# EAGLE design markIII_adapter (EAGLE 7.6.0)
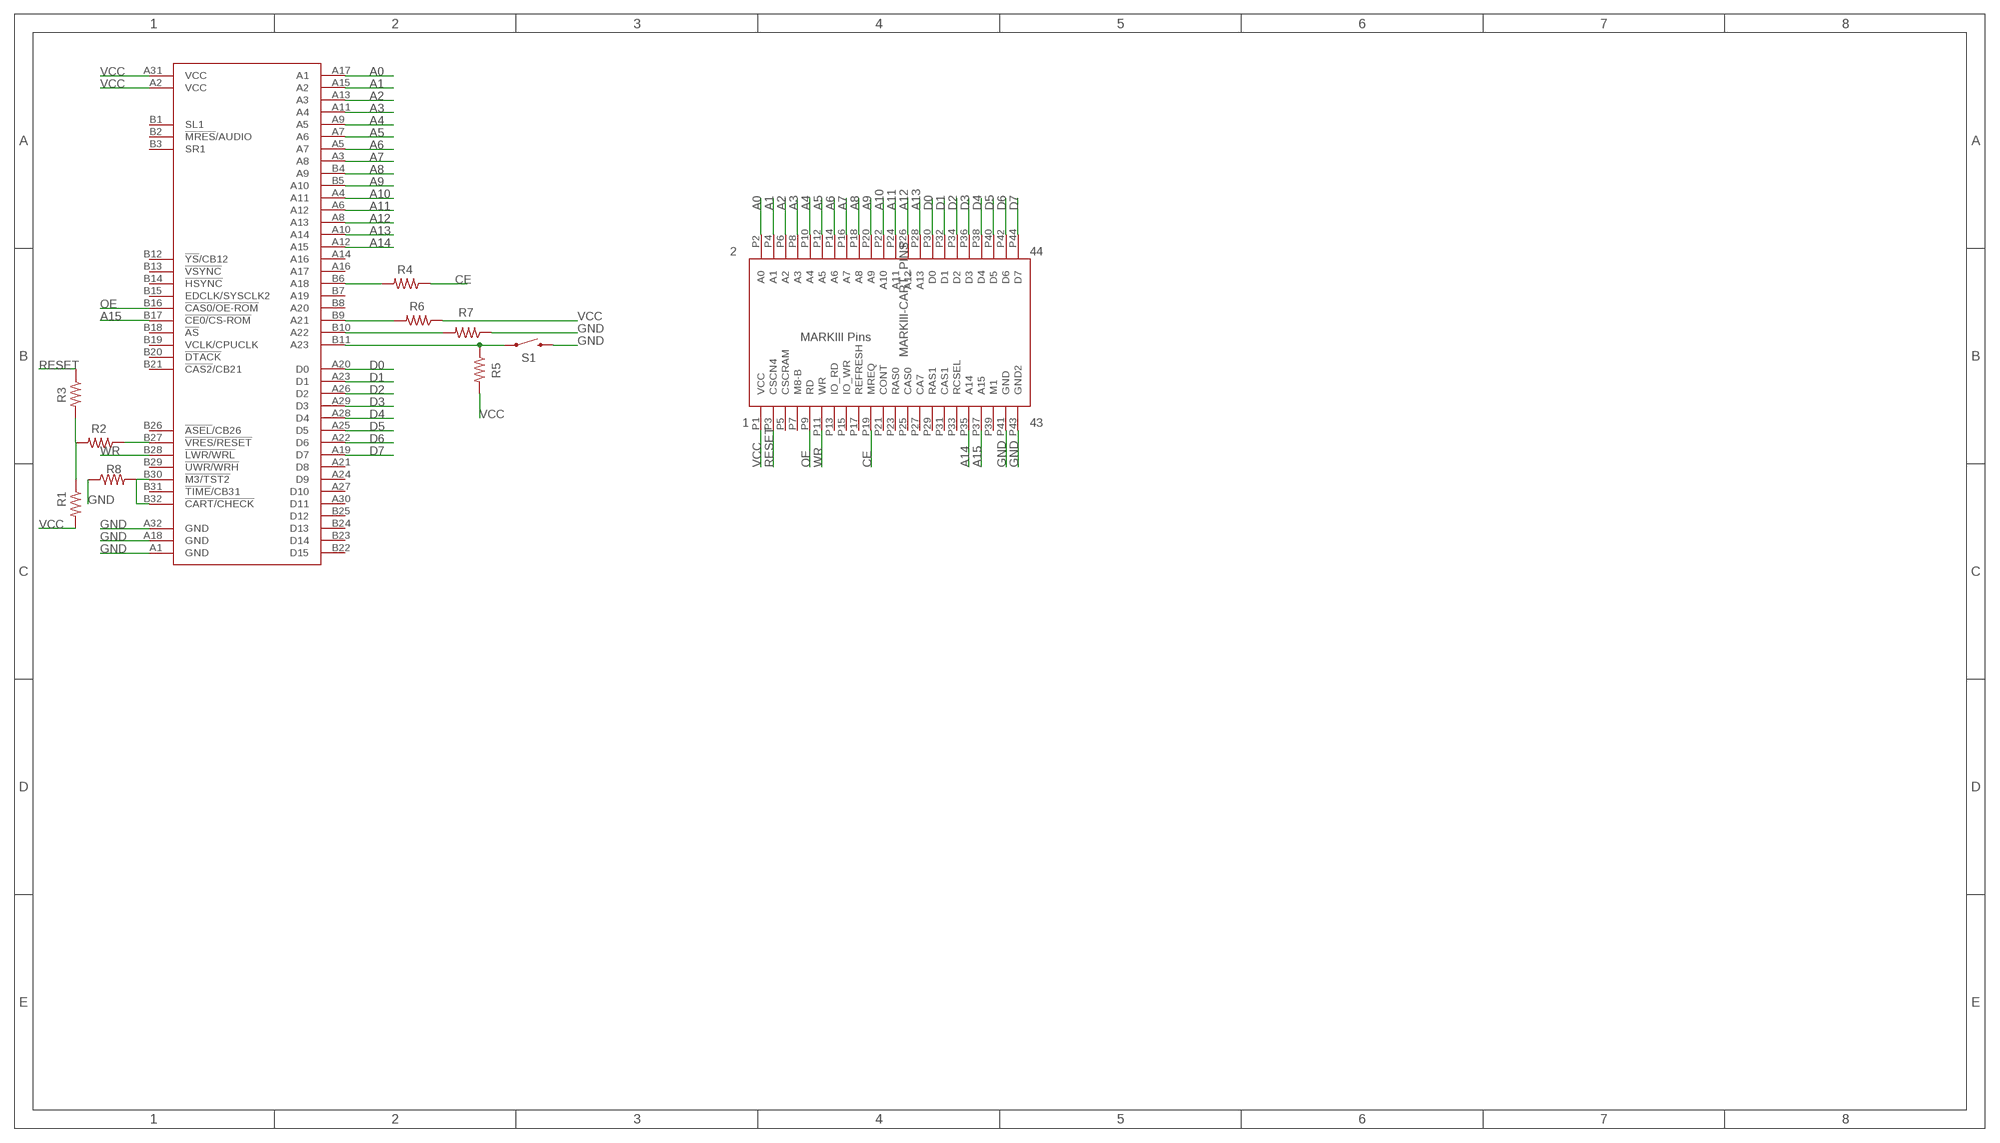
[diagram p0: schematic, sheet 1]

## Parts
CN3  MEGADRIVE-CART-CONNECTOR-ORDERED  [MEGADRIVE-CART-CONNECTOR]
R1  0  R-US_M1206  [M1206]
R2  NP  R-US_M1206  [M1206]
R3  NP  R-US_M1206  [M1206]
R4  0  R-US_M1206  [M1206]
R5  56K  R-US_M1206  [M1206]
R6  0  R-US_M1206  [M1206]
R7  0  R-US_M1206  [M1206]
R8  0  R-US_M1206  [M1206]
S1  MOMENTARY-SWITCH-SPST-SMD-5.2MM  [TACTILE_SWITCH_SMD_5.2MM]
U$1  MARKIII-CART_PINS  [MARKIII_PINS]

## Nets
A0: CN3.A17(A1) U$1.P2(A0)
A1: CN3.A15(A2) U$1.P4(A1)
A2: CN3.A13(A3) U$1.P6(A2)
A3: CN3.A11(A4) U$1.P8(A3)
A4: CN3.A9(A5) U$1.P10(A4)
A5: CN3.A7(A6) U$1.P12(A5)
A6: CN3.A5(A7) U$1.P14(A6)
A7: CN3.A3(A8) U$1.P16(A7)
A8: CN3.B4(A9) U$1.P18(A8)
A9: CN3.B5(A10) U$1.P20(A9)
A10: CN3.A4(A11) U$1.P22(A10)
A11: CN3.A6(A12) U$1.P24(A11)
A12: CN3.A8(A13) U$1.P26(A12)
A13: CN3.A10(A14) U$1.P28(A13)
A14: CN3.A12(A15) U$1.P35(A14)
A15: CN3.B17(!CE0/CS-ROM) U$1.P37(A15)
CE: R4.1 U$1.P19(MREQ)
D0: CN3.A20(D0) U$1.P30(D0)
D1: CN3.A23(D1) U$1.P32(D1)
D2: CN3.A26(D2) U$1.P34(D2)
D3: CN3.A29(D3) U$1.P36(D3)
D4: CN3.A28(D4) U$1.P38(D4)
D5: CN3.A25(D5) U$1.P40(D5)
D6: CN3.A22(D6) U$1.P42(D6)
D7: CN3.A19(D7) U$1.P44(D7)
GND [gnd]: CN3.A1(GND) CN3.A18(GND) CN3.A32(GND) R7.1 R8.1 S1.3 U$1.P41(GND) U$1.P43(GND2)
N$1: CN3.B11(A23) R5.1 S1.1
N$2: CN3.B10(A22) R7.2
N$3: CN3.B9(A21) R6.2
N$4: R1.1 R2.2 R3.2
N$5: CN3.B30(!M3/TST2) CN3.B32(!CART/CHECK) R8.2
N$6: CN3.B27(!VRES/RESET) R2.1
N$7: CN3.B6(A18) R4.2
OE: CN3.B16(!CAS0/OE-ROM) U$1.P9(RD)
RESET: R3.1 U$1.P3(CSCN4)
VCC [power]: CN3.A2(VCC) CN3.A31(VCC) R1.2 R5.2 R6.1 U$1.P1(VCC)
WR: CN3.B28(!LWR/WRL) U$1.P11(WR)
Unconnected: CN3.A14(A16) CN3.A16(A17) CN3.A21(D8) CN3.A24(D9) CN3.A27(D10) CN3.A30(D11) CN3.B1(SL1) CN3.B2(!MRES!/AUDIO) CN3.B3(SR1) CN3.B7(A19) CN3.B8(A20) CN3.B12(!YS!/CB12) CN3.B13(!VSYNC) CN3.B14(!HSYNC) CN3.B15(EDCLK/SYSCLK2) CN3.B18(!AS) CN3.B19(VCLK/CPUCLK) CN3.B20(!DTACK) CN3.B21(!CAS2!/CB21) CN3.B22(D15) CN3.B23(D14) CN3.B24(D13) CN3.B25(D12) CN3.B26(!ASEL!/CB26) CN3.B29(!UWR/WRH) CN3.B31(!TIME!/CB31) U$1.P5(CSCRAM) U$1.P7(M8-B) U$1.P13(IO_RD) U$1.P15(IO_WR) U$1.P17(REFRESH) U$1.P21(CONT) U$1.P23(RAS0) U$1.P25(CAS0) U$1.P27(CA7) U$1.P29(RAS1) U$1.P31(CAS1) U$1.P33(RCSEL) U$1.P39(M1)

## Library data of the parts
CN3 = arcadetv:MEGADRIVE-CART-CONNECTOR-ORDERED
R1-R8 = adafruit:R-US_: RESISTOR, American symbol
S1 = !sanni:MOMENTARY-SWITCH-SPST: Momentary Switch (Pushbutton) - SPST Normally-open (NO) SPST momentary switches (buttons, pushbuttons). Variants PTH-12MM - 12mm square, through-hole Momentary Pushbutton Switch - 12mm Square <https://www.sparkfun.com/products/9190> (COM-09190) PTH-6.0MM, PTH-6.0MM-KIT - 6.0mm square, through-hole Mini Pushbutton Switch <https://www.sparkfun.com/products/97> (COM-00097) KIT package intended for soldering kit's - only one side of pads' copper is exposed. PTH-RIGHT-ANGLE-KIT - Right-angle, through-hole Right Angle Tactile Button <https://www.sparkfun.com/products/10791> - Used on SparkFun BigTime Watch Kit <https://www.sparkfun.com/products/11734> SMD-12MM - 12mm square, surface-mount Tactile Button - SMD (12mm) <https://www.sparkfun.com/products/12993> (COM-12993) Used on SparkFun PicoBoard <https://www.sparkfun.com/products/11888> SMD-4.5MM - 4.5mm Square Trackball Switch Used on SparkFun Blackberry Trackballer Breakout <https://www.sparkfun.com/products/13169> SMD-4.6MMX2.8MM - 4.60mm x 2.80mm, surface mount Used on SparkFun SAMD21 Mini Breakout <https://www.sparkfun.com/products/13664> SMD-5.2MM, SMD-5.2-REDUNDANT - 5.2mm square, surface-mount Mini Pushbutton Switch - SMD <https://www.sparkfun.com/products/8720> (COM-08720) Used on Arduino Pro Mini <https://www.sparkfun.com/products/11114> REDUNDANT package connects both switch circuits together SMD-6.0X3.5MM - 6.0 x 3.5mm, surface mount Momentary Reset Switch SMD <https://www.sparkfun.com/products/8229> (COM-08229) SMD-6.2MM-TALL - 6.2mm square, surface mount Tactile Button - SMD (6mm) <https://www.sparkfun.com/products/12992> Used on SparkFun Digital Sandbox <https://www.sparkfun.com/products/12651> SMD-RIGHT-ANGLE - Right-angle, surface mount Used on SparkFun Block for Intel® Edison - Arduino <https://www.sparkfun.com/products/13036>; PROD_ID: SWCH-08247; SF_SKU: COM-08720
U$1 = !sanni_mod5:MARKIII-CART_PINS

## Net classes
0 default: width 0.254 mm, drill 0.305 mm, clearance 0.203 mm
1 power: width 0.61 mm, drill 0.406 mm, clearance 0.203 mm
2 gnd: width 0.61 mm, drill 0.406 mm, clearance 0.203 mm
3 power usb: width 0.61 mm, drill 0.406 mm, clearance 0.203 mm

## Board
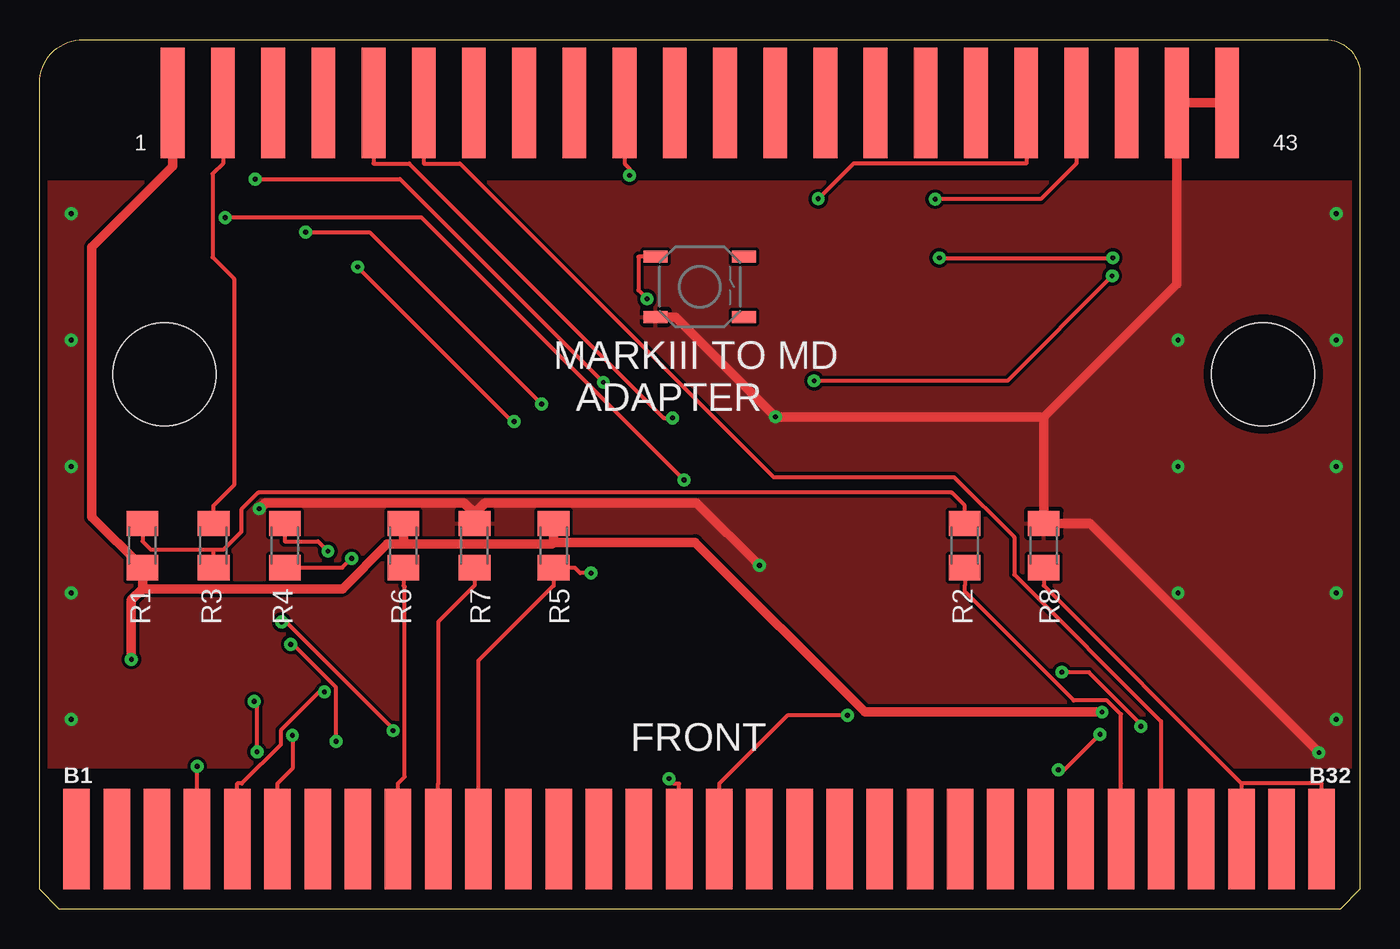
[diagram p1: board, top side]
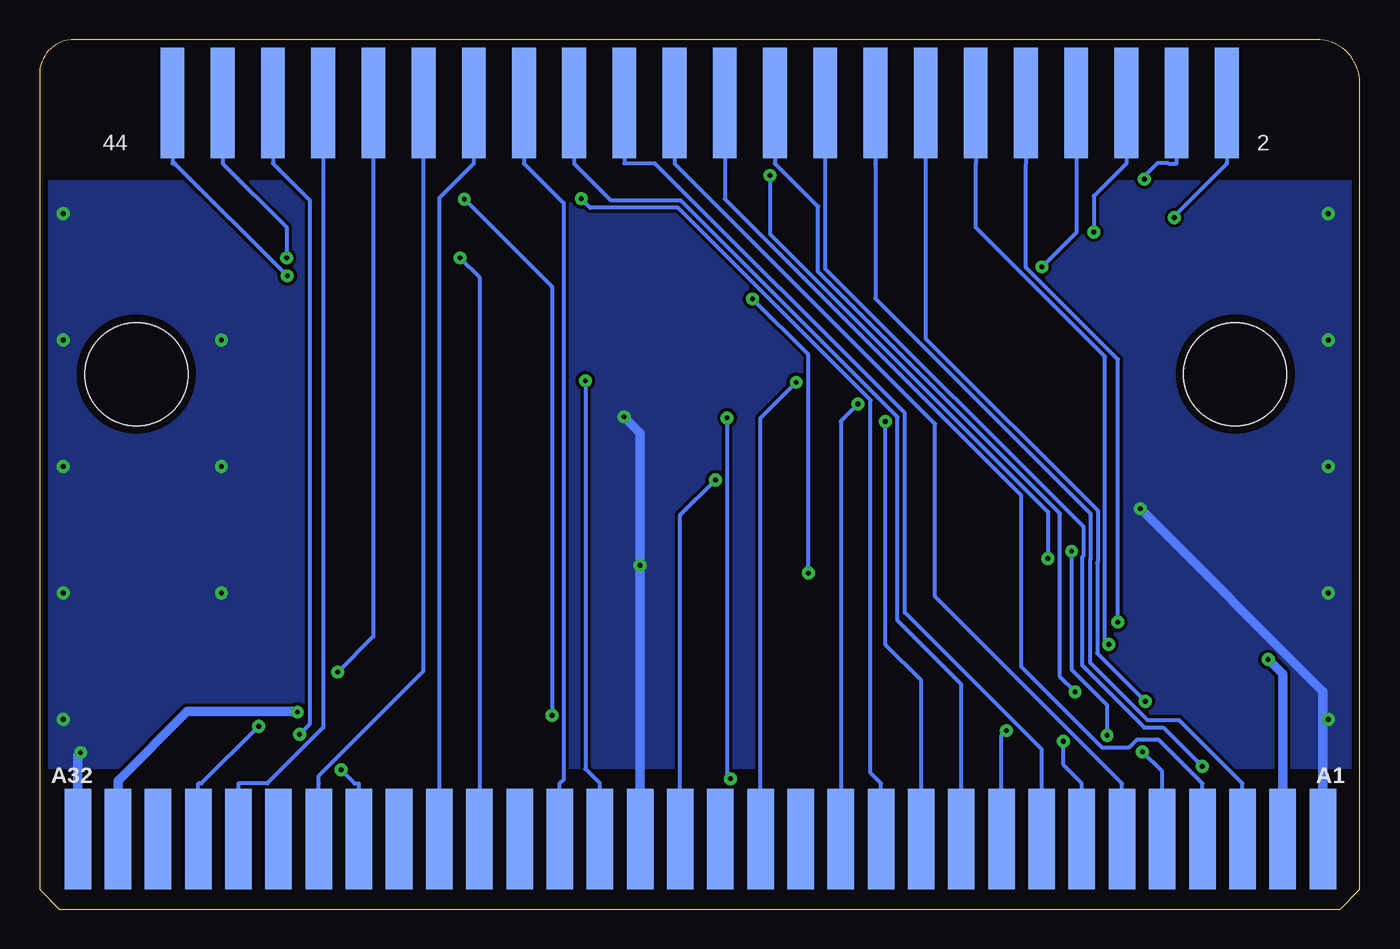
[diagram p2: board, bottom side, seen from below]

Size 83.51 x 55.01 mm. Coordinates in mm from the lower left corner, seen from the top.
Outline: 2.51,55 81.11,55 arc-90 83.51,53 83.51,1.25 82.26,0 1.26,0 0.01,1.25 0.01,52 arc-90 2.51,55
Copper layers (1*16): Top 0.035mm / dielectric 1.5mm / Bottom 0.035mm
Design rules "SparkFun_small": minimum track width 8mil, minimum drill 12mil, track to track 8mil, track to pad 8mil, pad to pad 8mil, via to via 8mil, smd to smd 8mil, copper to edge 20mil, drill to drill 12mil, minimum pad ring 12mil, minimum via ring 10mil, stop-mask expansion 4mil, vias tented up to drill 25mil, thermal gap 10mil
Holes 6.5 mm at 7.89,33.84 77.39,33.84
tRestrict: area 0,0 to 83.5,1.5
bRestrict: area 0,0 to 83.5,1.5

### Footprints (pad centres in the part's own frame; a part is rotated, then mirrored left to right if it is on the bottom)
MEGADRIVE-CART-CONNECTOR = smd 1.676 x 6.35 bottom: A1 0.838,3.175; A2 3.378,3.175; A3 5.918,3.175; A4 8.458,3.175; A5 10.998,3.175; A6 13.538,3.175; A7 16.078,3.175; A8 18.618,3.175; A9 21.158,3.175; A10 23.698,3.175; A11 26.238,3.175; A12 28.778,3.175; A13 31.318,3.175; A14 33.858,3.175; A15 36.398,3.175; A16 38.938,3.175; A17 41.478,3.175; A18 44.018,3.175; A19 46.558,3.175; A20 49.098,3.175; A21 51.638,3.175; A22 54.178,3.175; A23 56.718,3.175; A24 59.258,3.175; A25 61.798,3.175; A26 64.338,3.175; A27 66.878,3.175; A28 69.418,3.175; A29 71.958,3.175; A30 74.498,3.175; A31 77.038,3.175; A32 79.578,3.175 | smd 1.676 x 6.35: B1 0.838,3.175; B2 3.378,3.175; B3 5.918,3.175; B4 8.458,3.175; B5 10.998,3.175; B6 13.538,3.175; B7 16.078,3.175; B8 18.618,3.175; B9 21.158,3.175; B10 23.698,3.175; B11 26.238,3.175; B12 28.778,3.175; B13 31.318,3.175; B14 33.858,3.175; B15 36.398,3.175; B16 38.938,3.175; B17 41.478,3.175; B18 44.018,3.175; B19 46.558,3.175; B20 49.098,3.175; B21 51.638,3.175; B22 54.178,3.175; B23 56.718,3.175; B24 59.258,3.175; B25 61.798,3.175; B26 64.338,3.175; B27 66.878,3.175; B28 69.418,3.175; B29 71.958,3.175; B30 74.498,3.175; B31 77.038,3.175; B32 79.578,3.175
M1206 = smd 1.6 x 2: 1 -1.4,0; 2 1.4,0
TACTILE_SWITCH_SMD_5.2MM = smd 1.524 x 0.762: 1 -2.794,1.905; 2 2.794,1.905; 3 -2.794,-1.905; 4 2.794,-1.905
MARKIII_PINS = smd 1.5 x 7: P1 -33.337,0; P3 -30.163,0; P5 -26.988,0; P7 -23.812,0; P9 -20.637,0; P11 -17.462,0; P13 -14.287,0; P15 -11.113,0; P17 -7.938,0; P19 -4.763,0; P21 -1.587,0; P23 1.587,0; P25 4.763,0; P27 7.938,0; P29 11.113,0; P31 14.287,0; P33 17.462,0; P35 20.637,0; P37 23.812,0; P39 26.988,0; P41 30.163,0; P43 33.337,0 | smd 1.5 x 7 bottom: P2 -33.337,0; P4 -30.163,0; P6 -26.988,0; P8 -23.812,0; P10 -20.637,0; P12 -17.462,0; P14 -14.287,0; P16 -11.113,0; P18 -7.938,0; P20 -4.763,0; P22 -1.587,0; P24 1.587,0; P26 4.763,0; P28 7.938,0; P30 11.113,0; P32 14.287,0; P34 17.462,0; P36 20.637,0; P38 23.812,0; P40 26.988,0; P42 30.163,0; P44 33.337,0

### Placement (x,y rotation side)
CN3  1.51,1.27 0 top
R1  6.51,23 270 top
R2  58.51,23 90 top
R3  11.01,23 270 top
R4  15.51,23 90 top
R5  32.51,23 90 top
R6  23.01,23 270 top
R7  27.51,23 270 top
R8  63.51,23 270 top
S1  41.76,39.36 0 top
U$1  41.76,51 0 top

### Tracks (layer width: path | path; a pad name or v marks a point on that pad's centre or on a via)
A0  (via drill 0.3 pad 0.81)
  Top 0.254: v40.77,27.14 24.16,43.75 v11.75,43.75
  Bottom 0.254: v11.75,43.75 11.75,43.85 8.42,47.17 U$1.P2 | CN3.A17 42.99,24.92 v40.77,27.14
A1  (via drill 0.3 pad 0.81)
  Top 0.254: v13.63,46.19 22.79,46.19 v35.65,33.33
  Bottom 0.254: v13.63,46.19 13.63,46.35 12.78,47.21 12.17,47.21 12.13,47.17 11.6,47.17 U$1.P4 | CN3.A15 37.91,31.07 v35.65,33.33
A2  (via drill 0.3 pad 0.81)
  Top 0.254: v16.83,42.82 20.87,42.82 v31.75,31.94
  Bottom 0.254: v31.75,31.94 32.83,30.86 CN3.A13 | U$1.P6 14.77,47.17 16.83,45.11 v16.83,42.82
A3  (via drill 0.3 pad 0.81)
  Top 0.254: v20.12,40.62 29.9,30.85 v30.01,30.85
  Bottom 0.254: CN3.A11 27.75,14.46 30.01,16.72 v30.01,30.85 | U$1.P8 17.95,42.79 v20.12,40.62
A4  (via drill 0.3 pad 0.81)
  Top 0.254: v22.36,11.29 22.36,11.4 15.6,18.16 v15.31,18.16
  Bottom 0.254: v15.31,18.16 15.31,34.78 21.12,40.59 21.12,47.17 U$1.P10 | CN3.A9 22.67,10.98 v22.36,11.29
A5  (via drill 0.3 pad 0.81)
  Top 0.254: v18.76,10.61 18.76,14.04 16.04,16.76 v15.89,16.76
  Bottom 0.254: v18.76,10.61 18.76,9.12 17.59,7.95 CN3.A7 | v15.89,16.76 16.13,17 16.13,34.95 24.3,43.12 24.3,47.17 U$1.P12
A6  (via drill 0.3 pad 0.81)
  Top 0.254: v13.75,9.96 13.75,12.97 v13.58,13.15
  Bottom 0.254: U$1.P14 27.47,36.1 16.59,25.22 16.59,21.96 16.62,21.93 16.62,16.19 v13.58,13.15 | CN3.A5 12.51,8.72 v13.75,9.96
A7
  Bottom 0.254: U$1.P16 30.65,47.17 30.65,38.63 17.05,25.03 17.05,22.15 17.08,22.11 17.08,15.61 13.44,11.96 11.44,11.96 7.43,7.95 CN3.A3
A8  (via drill 0.3 pad 0.81)
  Top 0.254: CN3.B4 v9.97,9.03
  Bottom 0.254: v9.97,9.03 12.44,11.5 13.65,11.5 17.59,15.44 17.59,22.25 17.5,22.34 17.5,24.19 33.82,40.51 33.82,47.17 U$1.P18
A9  (via drill 0.3 pad 0.81)
  Top 0.254: v18.02,13.74 17.69,13.74 15.26,11.31 15.26,10.41 12.8,7.95 12.51,7.95 CN3.B5
  Bottom 0.254: v18.02,13.74 18.98,14.7 18.98,25.02 34.28,40.32 34.28,44.45 37,47.17 U$1.P20
A10
  Bottom 0.254: CN3.A4 9.97,7.95 12.76,10.74 14.09,10.74 14.59,10.24 16.31,10.24 21.44,15.37 21.44,26.19 40.17,44.92 U$1.P22
A11
  Bottom 0.254: CN3.A6 15.05,7.95 26.87,19.77 26.87,30.69 43.35,47.17 U$1.P24
A12
  Bottom 0.254: U$1.P26 46.52,47.17 44.59,47.17 28.79,31.37 28.79,18.77 20.13,10.11 20.13,7.95 CN3.A8
A13
  Bottom 0.254: CN3.A10 25.21,7.95 25.21,14.22 29.25,18.25 29.25,31.13 42.95,44.83 47.36,44.83 49.7,47.17 U$1.P28
A14  (via drill 0.3 pad 0.81)
  Top 0.254: U$1.P35 62.4,47.17 51.48,47.17 v49.25,44.94
  Bottom 0.254: v49.25,44.94 48.69,44.37 43.14,44.37 30.96,32.19 30.96,8.62 30.29,7.95 CN3.A12
A15  (via drill 0.3 pad 0.81)
  Top 0.254: U$1.P37 65.57,47.17 63.32,44.91 v56.64,44.91 | CN3.B17 42.99,7.95 47.3,12.26 v51.11,12.26
  Bottom 0.254: v56.64,44.91 51.11,39.38 v51.11,12.26
CE  (via drill 0.3 pad 0.81)
  Top 0.254: v19.73,22.18 19.15,21.6 16.84,21.6 R4.1 | v37.31,46.41 37.31,46.86 37,47.17 U$1.P19
  Bottom 0.254: v37.31,46.41 37.31,42.71 19.73,25.13 v19.73,22.18
D0
  Bottom 0.254: CN3.A20 50.61,7.95 50.37,8.19 50.37,44.66 52.87,47.17 U$1.P30
D1
  Bottom 0.254: U$1.P32 56.05,47.17 58.23,44.99 CN3.A23
D2
  Bottom 0.254: U$1.P34 59.22,15.07 65.85,8.45 65.85,7.95 CN3.A26
D3  (via drill 0.3 pad 0.81)
  Top 0.254: v69.66,11.56 69.66,11.7 66.37,14.99 v64.66,14.99
  Bottom 0.254: CN3.A29 73.47,7.95 73.27,7.95 v69.66,11.56 | U$1.P36 62.4,17.25 v64.66,14.99
D4
  Bottom 0.254: CN3.A28 70.93,7.95 69.11,7.95 65.57,11.49 65.57,47.17 U$1.P38
D5  (via drill 0.3 pad 0.81)
  Top 0.254: v64.45,8.81 64.81,8.81 v67.07,11.07
  Bottom 0.254: v67.07,11.07 66.41,11.73 66.41,44.83 68.75,47.17 U$1.P40 | CN3.A25 63.31,7.95 63.59,7.95 v64.45,8.81
D6  (via drill 0.3 pad 0.81)
  Top 0.254: v56.91,41.2 v67.89,41.2
  Bottom 0.254: v67.89,41.2 67.89,43.13 71.92,47.17 U$1.P42 | v56.91,41.2 55.69,39.98 CN3.A22
D7  (via drill 0.3 pad 0.81)
  Top 0.254: v67.84,40.06 61.2,33.42 v48.99,33.42
  Bottom 0.254: U$1.P44 75.1,47.17 74.95,47.17 v67.84,40.06 | CN3.A19 48.07,7.95 48.99,8.87 v48.99,33.42
GND  (via drill 0.3 pad 0.81)
  Top 0.61: U$1.P43 U$1.P41 71.92,46.99 71.92,39.55 63.51,31.14 | 27.51,25.05 26.86,25.71 14.27,25.71 v13.89,25.33 | 27.51,25.05 28.17,25.71 41.56,25.71 v45.53,21.73 | v80.92,9.9 66.42,24.4 R8.1 63.51,31.14 | 63.51,31.14 v46.55,31.14 40.24,37.45 S1.3 | R7.1 27.51,25.05
  Bottom 0.61: CN3.A1 2.35,13.79 v13.89,25.33 | CN3.A32 81.09,9.73 v80.92,9.9 | v46.55,31.14 45.53,30.12 v45.53,21.73 45.53,8.13 CN3.A18
  other vias: 2.01,44 2.01,36 2.01,28 2.01,20 2.01,12 82.01,12 82.01,20 72.01,20 72.01,28 82.01,28 82.01,44 82.01,36 72.01,36
  pour Bottom: 0.01,46 83.51,46 83.51,9 0.01,9
  pour Top: 0.01,46 83.51,46 83.51,9 0.01,9
N$1  (via drill 0.3 pad 0.81)
  Top 0.254: v38.42,38.6 37.88,39.14 37.88,41.27 S1.1 | v34.89,21.26 34.19,21.26 33.84,21.6 R5.1 32.51,20.47 27.75,15.71 CN3.B11
  Bottom 0.254: v34.89,21.26 34.89,35.07 v38.42,38.6
N$2
  Top 0.254: CN3.B10 25.21,7.95 25.21,18.17 27.51,20.47 R7.2
N$3
  Top 0.254: R6.2 23.01,20.47 23.1,20.38 23.1,8.38 22.67,7.95 CN3.B9
N$4
  Top 0.254: R2.2 58.51,25.53 57.7,26.34 13.83,26.34 12.76,25.27 12.76,23.87 11.62,22.73 11.01,22.73 | R3.2 11.01,22.73 | R1.1 6.51,23.27 7.05,22.73 11.01,22.73
N$5
  Top 0.254: 76.01,7.95 CN3.B30 | 76.01,7.95 76.01,7.97 63.51,20.47 R8.2 | 76.01,7.95 81.09,7.95 CN3.B32
N$6
  Top 0.254: CN3.B27 68.39,7.95 68.39,12.32 67.51,13.2 65.4,13.2 58.51,20.1 58.51,20.47 R2.1
N$7  (via drill 0.3 pad 0.81)
  Top 0.254: R4.2 15.51,23.27 17.61,23.27 v18.24,22.64 | CN3.B6 15.05,7.95 15.99,8.89 v15.99,11
  Bottom 0.254: v18.24,22.64 18.24,15.16 15.99,12.92 v15.99,11
OE  (via drill 0.3 pad 0.81)
  Top 0.254: v40.02,31.08 39.47,31.08 23.38,47.17 21.12,47.17 U$1.P9 | v39.81,8.25 40.11,7.95 40.45,7.95 CN3.B16
  Bottom 0.254: v40.02,31.08 40.02,8.47 v39.81,8.25
RESET
  Top 0.254: R3.1 11.01,25.53 12.3,26.82 12.3,39.87 10.94,41.23 10.94,46.51 11.6,47.17 U$1.P3
VCC  (via drill 0.3 pad 0.81)
  Top 0.61: 6.51,20.27 5.81,19.56 v5.81,15.8 | U$1.P1 8.42,46.99 3.31,41.88 3.31,24.8 R1.2 6.51,20.95 6.51,20.27 | 6.51,20.27 19.16,20.27 21.98,23.09 23.01,23.09 | 32.51,23.2 41.46,23.2 52.19,12.47 v67.21,12.47 | 23.01,23.09 32.4,23.09 32.51,23.2 | 32.51,23.2 32.51,23.3 R5.2 | R6.1 23.01,23.09
  Bottom 0.61: CN3.A2 4.89,14.88 v5.81,15.8 | v67.21,12.47 67.25,12.52 74.16,12.52 78.55,8.13 CN3.A31
WR
  Top 0.254: U$1.P11 24.3,47.17 26.59,47.17 46.42,27.34 57.85,27.34 61.65,23.53 61.65,21.16 70.93,11.88 CN3.B28

### Text on the board
tNames: 1 | 43 | MARKIII TO MD / ADAPTER | FRONT
bNames: 2 | 44